# Altium project PCB.PrjPcb (part 4 of 8)

## Sheet POWER_MOTORS.SchDoc
size Tabloid; SheetNumber: 24; SheetTotal: 25; Sheet_Name: POWER; Size: 11x17
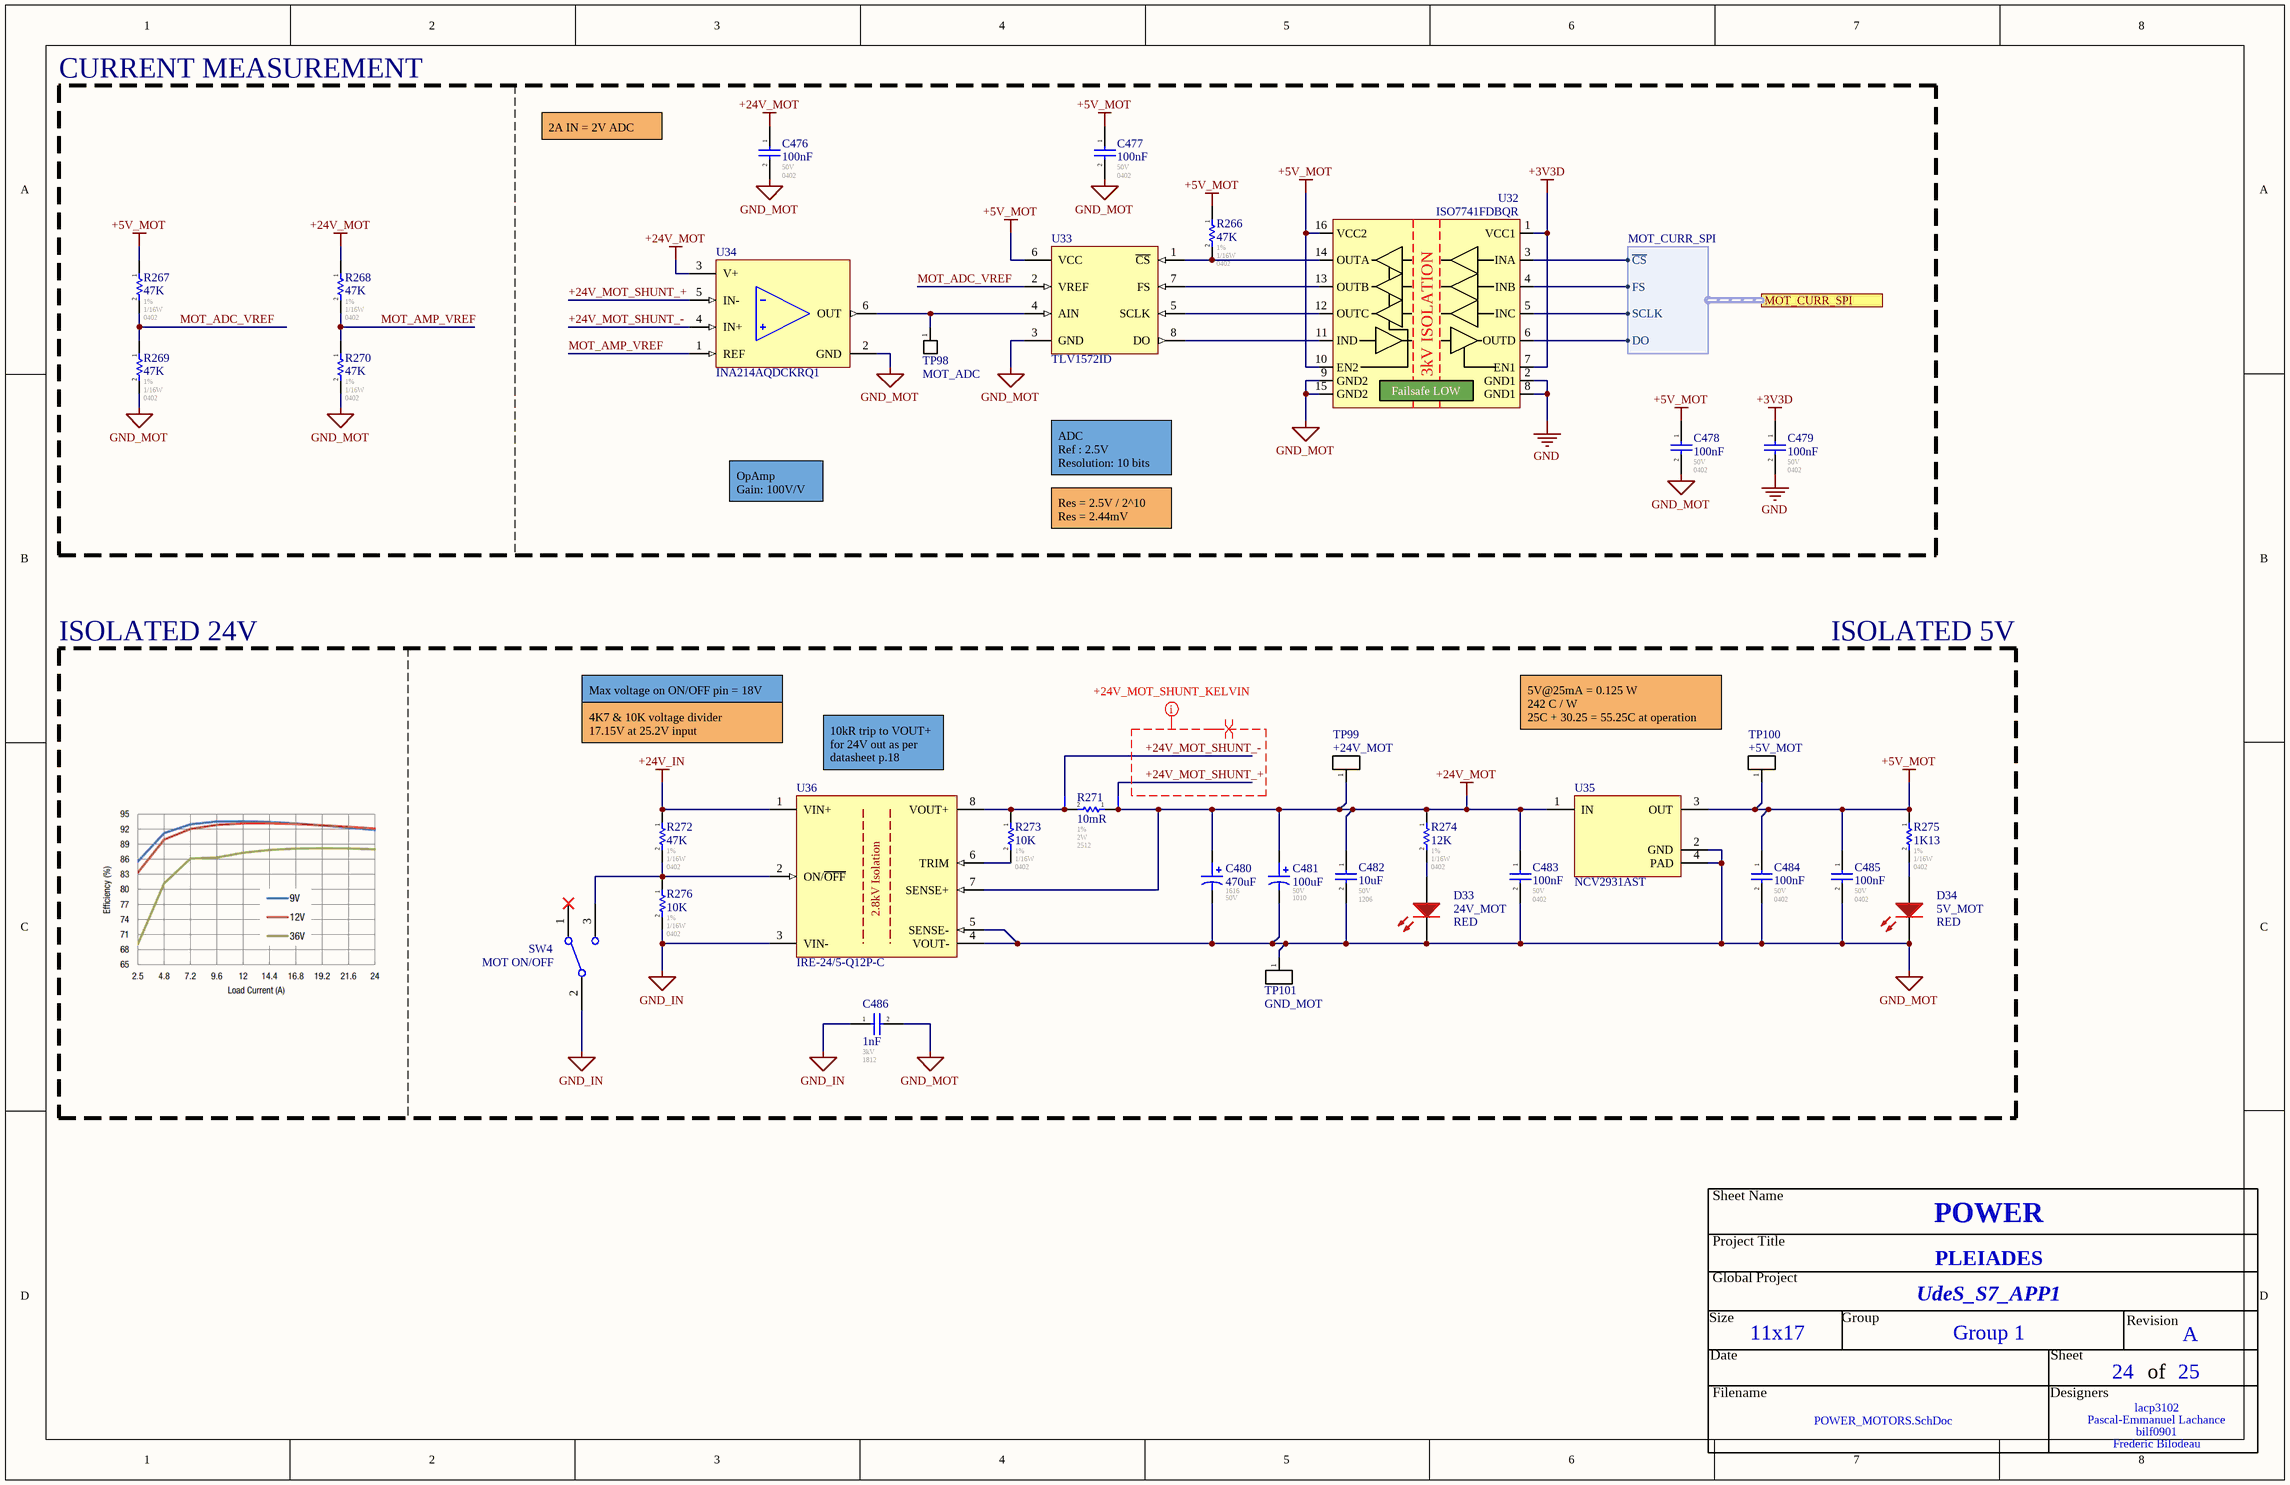
[diagram p22: POWER_MOTORS.SchDoc]

### Parts
C476  100nF  Voltage - Rated: 50V  Footprint: 0402  [CAP_0402]
C477  100nF  Voltage - Rated: 50V  Footprint: 0402  [CAP_0402]
C478  100nF  Voltage - Rated: 50V  Footprint: 0402  [CAP_0402]
C479  100nF  Voltage - Rated: 50V  Footprint: 0402  [CAP_0402]
C480  value 470uF  Voltage: 50V  Package: 1616  [CAP_ALU_1616_vishay]  (hidden comment: MAL214699108E3)
C481  value 100uF  Voltage: 50V  Package: 1010  [CAP_ALU_1010_vishay]  (hidden comment: MAL215099101E3)
C482  10uF  Voltage - Rated: 50V  Footprint: 1206  [CAP_1206]
C483  100nF  Voltage - Rated: 50V  Footprint: 0402  [CAP_0402]
C484  100nF  Voltage - Rated: 50V  Footprint: 0402  [CAP_0402]
C485  100nF  Voltage - Rated: 50V  Footprint: 0402  [CAP_0402]
C486  1nF  Voltage - Rated: 3kV  Footprint: 1812  [CAP_1812]
D33  24V_MOT  value RED  [LED_0603]
D34  5V_MOT  value RED  [LED_0603]
NT52  Net Tie  [NETTIE_5]  (value not drawn)  (net tie, no BOM)
NT53  Net Tie  [NETTIE_5]  (value not drawn)  (net tie, no BOM)
R266  47K  Tolerance: 1%  Power: 1/16W  Package / Case: 0402  [RES_0402]
R267  47K  Tolerance: 1%  Power: 1/16W  Package / Case: 0402  [RES_0402]
R268  47K  Tolerance: 1%  Power: 1/16W  Package / Case: 0402  [RES_0402]
R269  47K  Tolerance: 1%  Power: 1/16W  Package / Case: 0402  [RES_0402]
R270  47K  Tolerance: 1%  Power: 1/16W  Package / Case: 0402  [RES_0402]
R271  10mR  Tolerance: 1%  Power: 2W  Package / Case: 2512  [RES_2512]
R272  47K  Tolerance: 1%  Power: 1/16W  Package / Case: 0402  [RES_0402]
R273  10K  Tolerance: 1%  Power: 1/16W  Package / Case: 0402  [RES_0402]
R274  12K  Tolerance: 1%  Power: 1/16W  Package / Case: 0402  [RES_0402]
R275  1K13  Tolerance: 1%  Power: 1/16W  Package / Case: 0402  [RES_0402]
R276  10K  Tolerance: 1%  Power: 1/16W  Package / Case: 0402  [RES_0402]
SW4  MOT ON/OFF  [1101M2S3CQE2]
TP98  MOT_ADC  [TP_PAD]  (no BOM)
TP99  +24V_MOT  [TP_HOLE]  (no BOM)
TP100  +5V_MOT  [TP_HOLE]  (no BOM)
TP101  GND_MOT  [TP_HOLE]  (no BOM)
U32  ISO7741FDBQR  [ISO_ISO7741FDBQR]
U33  TLV1572ID  [SOIC-8_3.8mm]
U34  INA214AQDCKRQ1  [SC-70-6 (SOT-363)]
U35  NCV2931AST  [SOT223-4]
U36  IRE-24/5-Q12P-C  [IRE-Q12]

### Blocks framed on the sheet
CURRENT MEASUREMENT: C476-C479 R266-R270 TP98 U32-U34

### Ports
MOT_CURR_SPI (harness MOT_CURR_SPI)

### Harnesses
MOT_CURR_SPI: ~{CS}, FS, SCLK, DO

### Nets
+3V3D: C479.1 U32.1(VCC1) U32.7(EN1)
+5V_MOT: C477.1 C478.1 C484.1 C485.1 R266.1 R267.1 R275.1 TP100.1(A) U32.10(EN2) U32.16(VCC2) U33.6(VCC) U35.3(OUT)
+24V_IN: R272.1 U36.1(VIN+)
+24V_MOT: C476.1 C480.1 C481.1 C482.1 C483.1 NT53.1 R268.1 R271.1 R274.1 TP99.1(A) U34.3(V+) U35.1(IN) U36.7(SENSE+)
GND: C479.2 U32.2(GND1) U32.8(GND1)
GND_IN: C486.1 R276.2 SW4.2(P) U36.3(VIN-)
GND_MOT: C476.2 C477.2 C478.2 C480.2 C481.2 C482.2 C483.2 C484.2 C485.2 C486.2 D33.2(K) D34.2(K) R269.2 R270.2 TP101.1(A) U32.9(GND2) U32.15(GND2) U33.3(GND) U34.2(GND) U35.2(GND) U35.4(PAD) U36.4(VOUT-) U36.5(SENSE-)
+24V_MOT_SHUNT_+: NT53.2 U34.5(IN-)  [project net +24V_MOT_SHUNT_+_24]
+24V_MOT_SHUNT_-: NT52.2 U34.4(IN+)  [project net +24V_MOT_SHUNT_-_24]
MOT_ADC_VREF: R267.2 R269.1 U33.2(VREF)  [project net MOT_ADC_VREF_24]
MOT_AMP_VREF: R268.2 R270.1 U34.1(REF)  [project net MOT_AMP_VREF_24]
NetD33_1: D33.1(A) R274.2
NetD34_1: D34.1(A) R275.2
NetNT52_1: NT52.1 R271.2 R273.1 U36.8(VOUT+)
NetR266_2: R266.2 U32.14(OUTA) U33.1(~{CS})
NetR272_2: R272.2 R276.1 SW4.3(B) U36.2(ON/~{OFF})
NetR273_2: R273.2 U36.6(TRIM)
NetTP98_1: TP98.1(A) U33.4(AIN) U34.6(OUT)
NetU4_T18: U32.4(INB) ; port MOT_CURR_SPI.FS
NetU4_T19: U32.5(INC) ; port MOT_CURR_SPI.SCLK
NetU4_U21: U32.6(OUTD) ; port MOT_CURR_SPI.DO
NetU4_U23: U32.3(INA) ; port MOT_CURR_SPI.~{CS}
NetU32_11: U32.11(IND) U33.8(DO)
NetU32_12: U32.12(OUTC) U33.5(SCLK)
NetU32_13: U32.13(OUTB) U33.7(FS)

Not connected (* = marked no-connect by the designer): SW4 1(A)*

### Layout directives
net class +24V_MOT_SHUNT_KELVIN: +24V_MOT_SHUNT_+, +24V_MOT_SHUNT_-
differential pair: +24V_MOT_SHUNT_+, +24V_MOT_SHUNT_-

### Notes on the sheet
- 2A IN = 2V ADC
- OpAmp
  Gain: 100V/V
- ADC
  Ref : 2.5V
  Resolution: 10 bits
- Res = 2.5V / 2^10
  Res = 2.44mV
- ISOLATED 24V
- Max voltage on ON/OFF pin = 18V
- ISOLATED 5V
- 4K7 & 10K voltage divider
  17.15V at 25.2V input
- (near U36) 10kR trip to VOUT+ for 24V out as per datasheet p.18
- 5V@25mA = 0.125 W
  242 C / W
  25C + 30.25 = 55.25C at operation
- Sheet Name
- Project Title
- Global Project
- Revision
- Size
- Date
- Group
- Sheet
- of
- Filename
- Designers
- (in symbol IRE-24/5-Q12P-C) 2.8kV Isolation
- (in symbol ISO_ISO7741FDBQR) 3kV ISOLATION; Failsafe LOW

### Library data of the parts
C476-C479 C483-C485 = CAP_CER: as C222 on sheet POWER_INPUT; Operating Temperature: -55C - 125C; Temperature Coefficient: X7R; ComponentLink1Description: Digikey; ComponentLink1URL: [Digikey Link]; Part#: GCM155R71H104KE02J; ComponentLink2Description: Datasheet; ComponentLink2URL: [Datasheet Link]; Tolerance: 10%; Ratings: AEC-Q200
C480 = CAP_ALU_MAL214699108E3: CAP - ALU 470uF 20% 50V - 1616; Current: 1.3A; Mfg: Vishay Dale; Mfg Part Number: MAL214699108E3; HelpURL: http://www.vishay.com/docs/28403/146cti.pdf; CreatedBy: Jonathan Bouchard; Temperature: -55°C to 125°C; Power: *; Supplier 1: Digikey; Supplier Part Number 1: 4442PHCT-ND; Precision: 20%
C481 = CAP_ALU_MAL215099101E3: CAP - ALU 100uF 20% 50V - 1010; Current: 490mA; Mfg: Vishay Dale; Mfg Part Number: MAL215099101E3; HelpURL: http://www.vishay.com/docs/28395/150crz.pdf; CreatedBy: Jonathan Bouchard; Temperature: -55°C to 125°C; Power: *; Supplier 1: Digikey; Supplier Part Number 1: 4399PHDKR-ND; Precision: 20%
C482 = CAP_CER: as C221 on sheet POWER_INPUT; Operating Temperature: -55C - 85C; Temperature Coefficient: X5R; ComponentLink1Description: Digikey; ComponentLink1URL: [Digikey Link]; ComponentLink2Description: Datasheet; ComponentLink2URL: [Datasheet Link]; Tolerance: 10%; Ratings: AEC-Q200; Supplier 1: Arrow Electronics; Supplier Part Number 1: GRT31CR61H106KE01L; Part#: GRT31CR61H106KE01L
C486 = CAP_CER: C1812C102KHRACAUTO / 0402 470pF 10% X7R Ceramic Capacitor; Mfr: KEMET; Operating Temperature: -55C - 125C; Temperature Coefficient: X7R; ComponentLink1Description: Digikey; ComponentLink1URL: https://www.digikey.com/en/products/detail/kemet/C1812C102KHRACAUTO/8109956; Part#: C1812C102KHRACAUTO; ComponentLink2Description: Datasheet; ComponentLink2URL: https://connect.kemet.com:7667/gateway/IntelliData-ComponentDocumentation/1.0/download/datasheet/C1812C102KHRACAUTO; Tolerance: 10%; Ratings: AEC-Q200; ComponentLink3Description: KEMET; ComponentLink3URL: https://www.kemet.com/en/us/capacitors/ceramic/product/C1812C102KHRACAUTO.html; ComponentLink4Description: Octopart; ComponentLink4URL: https://octopart.com/c1812c102khracauto-kemet-67309371?r=sp; Features: Low ESL, High Voltage; Supplier 1: Mouser; Supplier Part Number 1: 80-C1812C102KHRAUTO
D33 D34 = LED_SML-311UTT86: as D4 on sheet POWER_INPUT; Current: 2mA; HelpURL: http://media.digikey.com/pdf/Data%20Sheets/Rohm%20PDFs/SML-311%20Series.pdf; CreatedBy: Jonathan Bouchard; Temperature: -30°C to 85°C; Package: 0603; Precision: *; Mfg Part Number: SML-311UTT86; Supplier 1: Digikey; Supplier Part Number 1: 511-1304-1-ND
NT52 NT53 = NET_TIE_SMALL
R266-R270 R272-R276 = RESISTOR: Automotive: AEC-Q200; Operating Temperature: *; # Digikey: *; ComponentLink1Description: Digikey; ComponentLink1URL: *; # Manufacturer: *
R271 = RESISTOR: CSRN2512FK10L0; Automotive: AEC-Q200; Operating Temperature: -55C - 155C; ComponentLink1Description: Digikey; ComponentLink1URL: https://www.digikey.ca/fr/products/detail/stackpole-electronics-inc/CSRN2512FK10L0/1646104; Part #: CSRN2512FK10L0
SW4 = SPDT_SWITCH: Slide Switch SPDT Through Hole; Mfr: C&K; Switch Function: On-Off-On; Current Rating: 6A; Voltage Rating - AC: 120V; Voltage Rating - DC: 28V; Cycles: 40000; Operating Temperature: -30C - 65C; ComponentLink1Description: Digikey; ComponentLink1URL: https://www.digikey.ca/en/products/detail/c-k/1103M2S3CQE2/483721; ComponentLink2Description: Datasheet; ComponentLink2URL: https://www.ckswitches.com/media/1429/1000.pdf; ComponentLink3Description: Octopart; ComponentLink3URL: https://octopart.com/1103m2s3cqe2-c%26k+components-2492778?r=sp; Supplier 1: Arrow Electronics; Supplier Part Number 1: 1103M2S3CQE2
TP98 = TESTPOINT_PAD: Test Point
TP99-TP101 = TESTPOINT: Test Point; ClassName: Testpoint
U32 = ISO_ISO7741FDBQR: ISO - Quad-Channel Digital Isolator 3/1 (Default Low)- 16-SSOP; Manufacturer #1: Texas Instruments; Voltage Rating: 2.25-5.5V; GRAMS Lib Spec: 2.8c; Magnetic Material: Unknown; Polarized: Yes; Value: 3/1; Tolerance: *; Current Rating: *; Power Max: *; HelpURL: http://www.ti.com/lit/ds/symlink/iso7741.pdf; CreatedBy/Date: Louis-Daniel Gaulin / 11-03-2020; VerifiedBy: c.Paulin - 20/04/2020; Temperature: -55°C ~ 125°C; Package: 16-SSOP; Manufacturer #2: *; Assembly Type: SMD; Part Number #2: *; Part Number #1: ISO7741FDBQR; Supplier 1: Digi-Key; Supplier Part Number 1: 296-48140-1-ND; Cryo: UNKNOWN
U33 = TLV1572ID: Mfr: Texas Instruments; Number of Bits: 10; Number of Inputs: 1; Architecture: SAR; Voltage - Supply (Analog): 2.7V - 5.5V; ComponentLink1Description: Digikey; ComponentLink1URL: https://www.digikey.ca/en/products/detail/texas-instruments/TLV1572ID/277528; ComponentLink2Description: Datasheet; ComponentLink2URL: https://www.ti.com/lit/ds/symlink/tlv1572.pdf?HQS=dis-dk-null-digikeymode-dsf-pf-null-wwe&ts=1706610861795&ref_url=https%253A%252F%252Fwww.ti.com%252Fgeneral%252Fdocs%252Fsuppproductinfo.tsp%253FdistId%253D10%2526gotoUrl%253Dhttps%253A%252F%252Fwww.ti.com%252Flit%252Fgpn%252Ftlv1572; ComponentLink3Description: Texas Instruments; ComponentLink3URL: https://www.ti.com/product/TLV1572; Voltage - Supply (Digital): 2.7V - 5.5V; Operating Temperature: -30C - 85C
U34 = INA214AQDCKRQ1: Current Sense Amplifier 1 Circuit Single-Ended SC-70-6; Mfr: Texas Instruments; Voltage - Supply (Min): 2.7V; Voltage - Supply (Max): 26V; Gain Bandwidth Product: 30kHz; Current - Input Bias: 28µA; Voltage - Input Offset: 1µV; Gain: 100V/V; ComponentLink1Description: Digikey; ComponentLink1URL: https://www.digikey.com/en/products/detail/texas-instruments/INA214AQDCKRQ1/2361055; ComponentLink2Description: Datasheet; ComponentLink2URL: https://www.ti.com/lit/ds/symlink/ina213-q1.pdf?HQS=dis-dk-null-digikeymode-dsf-pf-null-wwe&ts=1706525130563&ref_url=https%253A%252F%252Fwww.ti.com%252Fgeneral%252Fdocs%252Fsuppproductinfo.tsp%253FdistId%253D10%2526gotoUrl%253Dhttps%253A%252F%252Fwww.ti.com%252Flit%252Fgpn%252Fina213-q1; ComponentLink3Description: Octopart; ComponentLink3URL: https://octopart.com/ina214aqdckrq1-texas+instruments-18804705?r=sp; ComponentLink4Description: Texas Instruments; ComponentLink4URL: https://www.ti.com/product/INA214-Q1/part-details/INA214AQDCKRQ1; Operating Temperature: -40C - 125C; Ratings: AEC-Q100; Voltage - Analog Input (Max): 26V; Supplier 1: Mouser
U35 = NCV2931AST-5T3G: 5.0 V LDO; Voltage - Input (Max): 26V; Voltage - Output: 5V; Current - Output (Max): 100mA; Current - Quiescent: 1mA; Qualification: AEC-Q100; Operating Temperature: -40C - 125C; ComponentLink1Description: Digikey; ComponentLink1URL: https://www.digikey.ca/en/products/detail/onsemi/NCV2931AST-5T3G/1483949; ComponentLink2Description: Datasheet; ComponentLink2URL: https://www.onsemi.com/pdf/datasheet/lm2931-d.pdf
U36 = IRE-24/5-Q12P-C: Isolated DC/DC Converters - Through Hole 9V-36VIN 24VOUT 120W; Mfr: Murata; Voltage - Output: 24V; Current - Output: 5A; Voltage - Input (Min): 9V; Voltage - Input (Max): 36V; Isolation Voltage: 2.828kV; Switching Frequency: 240kHz; Output Power: 120W; Operating Temperature: -40C - 85C; ComponentLink1Description: Mouser; ComponentLink1URL: https://www.mouser.ca/ProductDetail/Murata-Power-Solutions/IRE-24-5-Q12P-C?qs=xZ%2FP%252Ba9zWqZkiEXUCSXVgg%3D%3D; ComponentLink2Description: Murata; ComponentLink2URL: https://www.murata.com/en-us/products/productdetail?partno=IRE-24%2F5-Q12P-C; ComponentLink3Description: Datasheet; ComponentLink3URL: https://www.murata.com/products/productdata/8807029112862/ire-q12.pdf?1655388012000; ComponentLink4Description: Octopart; ComponentLink4URL: https://octopart.com/ire-24%2F5-q12p-c-murata+power+solutions-107236523?r=sp; Supplier 1: Mouser; Supplier Part Number 1: 580-IRE-24/5-Q12P-C

## Sheet POWER_SENSING.SchDoc
size 558 x 431 mm; SheetNumber: 25; SheetTotal: 25; Sheet_Name: POWER; Size: 11x17
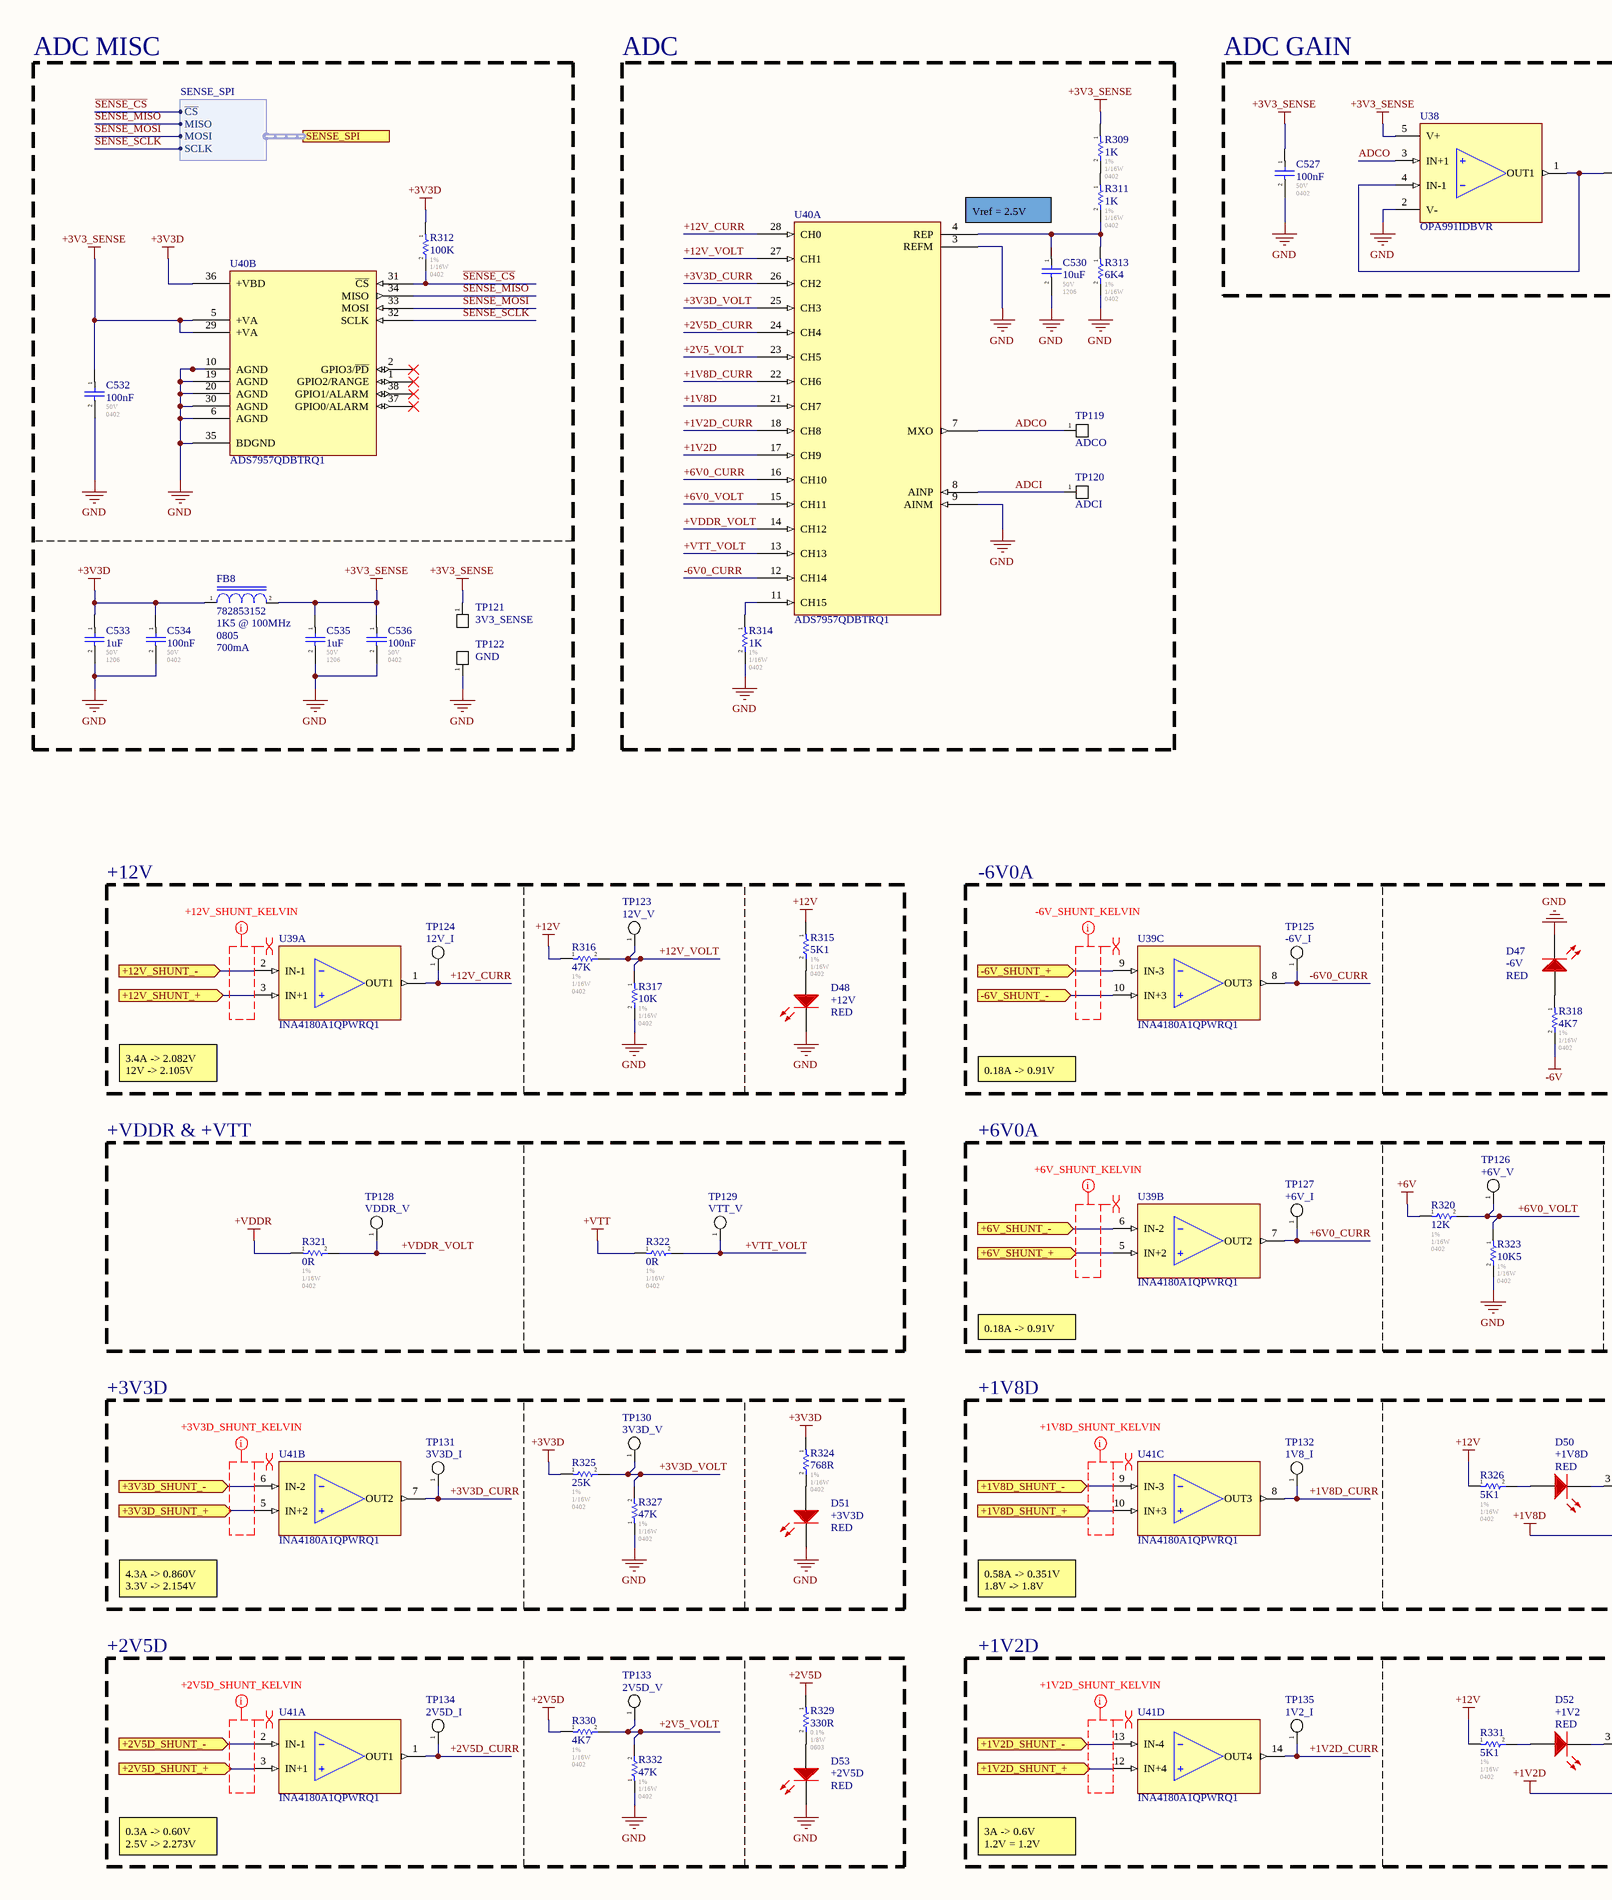
[diagram p23: POWER_SENSING.SchDoc, left]
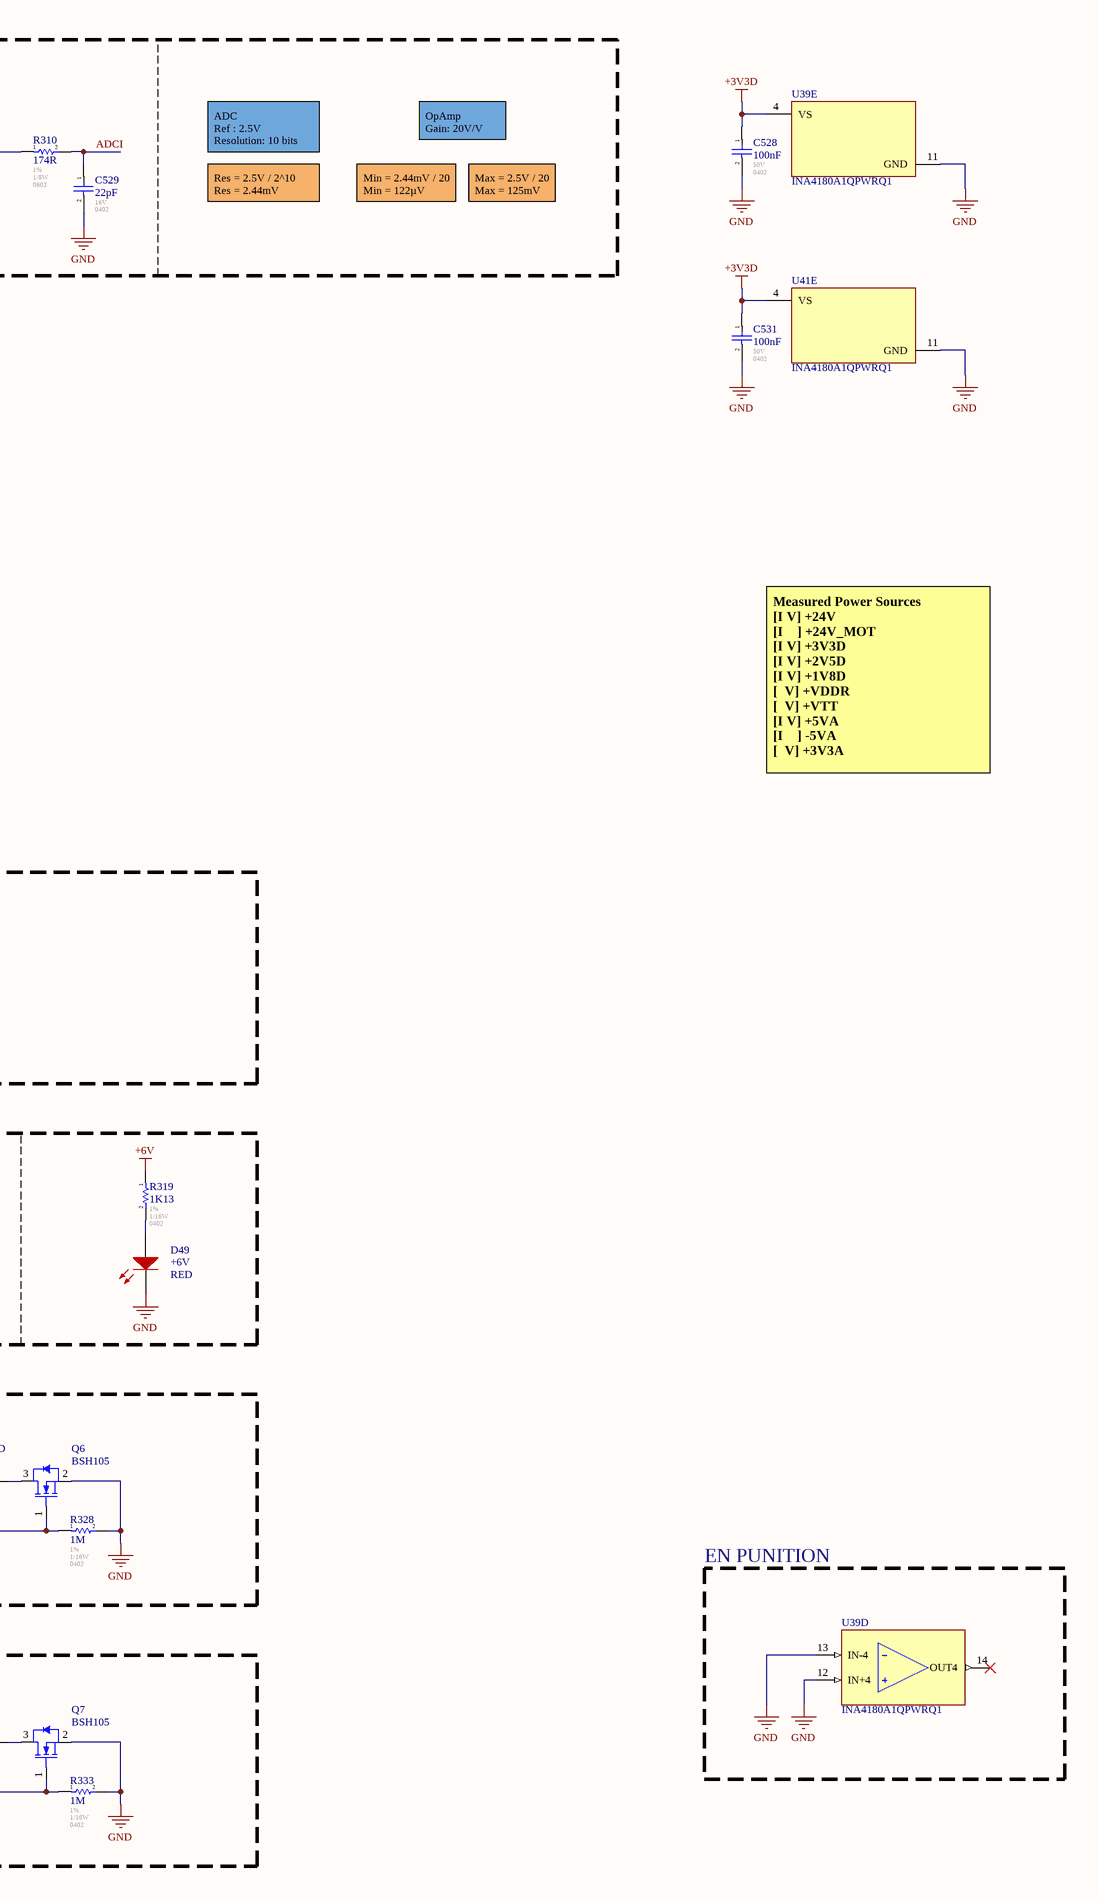
[diagram p24: POWER_SENSING.SchDoc, right]

### Parts
C527  100nF  Voltage - Rated: 50V  Footprint: 0402  [CAP_0402]
C528  100nF  Voltage - Rated: 50V  Footprint: 0402  [CAP_0402]
C529  22pF  Voltage - Rated: 16V  Footprint: 0402  [CAP_0402]
C530  10uF  Voltage - Rated: 50V  Footprint: 1206  [CAP_1206]
C531  100nF  Voltage - Rated: 50V  Footprint: 0402  [CAP_0402]
C532  100nF  Voltage - Rated: 50V  Footprint: 0402  [CAP_0402]
C533  1uF  Voltage - Rated: 50V  Footprint: 1206  [CAP_1206]
C534  100nF  Voltage - Rated: 50V  Footprint: 0402  [CAP_0402]
C535  1uF  Voltage - Rated: 50V  Footprint: 1206  [CAP_1206]
C536  100nF  Voltage - Rated: 50V  Footprint: 0402  [CAP_0402]
D47  -6V  value RED  [LED_0603]
D48  +12V  value RED  [LED_0603]
D49  +6V  value RED  [LED_0603]
D50  +1V8D  value RED  [LED_0603]
D51  +3V3D  value RED  [LED_0603]
D52  +1V2  value RED  [LED_0603]
D53  +2V5D  value RED  [LED_0603]
FB8  782853152  Impedance @ Freq: 1K5 @ 100MHz  Package / Case: 0805  Current Rating: 700mA  [IND_0805]
Q6  BSH105  [SOT23-3]
Q7  BSH105  [SOT23-3]
R309  1K  Tolerance: 1%  Power: 1/16W  Package / Case: 0402  [RES_0402]
R310  174R  Tolerance: 1%  Power: 1/8W  Package / Case: 0603  [RES_0603]
R311  1K  Tolerance: 1%  Power: 1/16W  Package / Case: 0402  [RES_0402]
R312  100K  Tolerance: 1%  Power: 1/16W  Package / Case: 0402  [RES_0402]
R313  6K4  Tolerance: 1%  Power: 1/16W  Package / Case: 0402  [RES_0402]
R314  1K  Tolerance: 1%  Power: 1/16W  Package / Case: 0402  [RES_0402]
R315  5K1  Tolerance: 1%  Power: 1/16W  Package / Case: 0402  [RES_0402]
R316  47K  Tolerance: 1%  Power: 1/16W  Package / Case: 0402  [RES_0402]
R317  10K  Tolerance: 1%  Power: 1/16W  Package / Case: 0402  [RES_0402]
R318  4K7  Tolerance: 1%  Power: 1/16W  Package / Case: 0402  [RES_0402]
R319  1K13  Tolerance: 1%  Power: 1/16W  Package / Case: 0402  [RES_0402]
R320  12K  Tolerance: 1%  Power: 1/16W  Package / Case: 0402  [RES_0402]
R321  0R  Tolerance: 1%  Power: 1/16W  Package / Case: 0402  [RES_0402]
R322  0R  Tolerance: 1%  Power: 1/16W  Package / Case: 0402  [RES_0402]
R323  10K5  Tolerance: 1%  Power: 1/16W  Package / Case: 0402  [RES_0402]
R324  768R  Tolerance: 1%  Power: 1/16W  Package / Case: 0402  [RES_0402]
R325  25K  Tolerance: 1%  Power: 1/16W  Package / Case: 0402  [RES_0402]
R326  5K1  Tolerance: 1%  Power: 1/16W  Package / Case: 0402  [RES_0402]
R327  47K  Tolerance: 1%  Power: 1/16W  Package / Case: 0402  [RES_0402]
R328  1M  Tolerance: 1%  Power: 1/16W  Package / Case: 0402  [RES_0402]
R329  330R  Tolerance: 0.1%  Power: 1/8W  Package / Case: 0603  [RES_0603]
R330  4K7  Tolerance: 1%  Power: 1/16W  Package / Case: 0402  [RES_0402]
R331  5K1  Tolerance: 1%  Power: 1/16W  Package / Case: 0402  [RES_0402]
R332  47K  Tolerance: 1%  Power: 1/16W  Package / Case: 0402  [RES_0402]
R333  1M  Tolerance: 1%  Power: 1/16W  Package / Case: 0402  [RES_0402]
TP119  ADCO  [TP_PAD]  (no BOM)
TP120  ADCI  [TP_PAD]  (no BOM)
TP121  3V3_SENSE  [TP_PAD]  (no BOM)
TP122  GND  [TP_PAD]  (no BOM)
TP123  12V_V  [TP_PAD_SMALL]  (no BOM)
TP124  12V_I  [TP_PAD_SMALL]  (no BOM)
TP125  -6V_I  [TP_PAD_SMALL]  (no BOM)
TP126  +6V_V  [TP_PAD_SMALL]  (no BOM)
TP127  +6V_I  [TP_PAD_SMALL]  (no BOM)
TP128  VDDR_V  [TP_PAD_SMALL]  (no BOM)
TP129  VTT_V  [TP_PAD_SMALL]  (no BOM)
TP130  3V3D_V  [TP_PAD_SMALL]  (no BOM)
TP131  3V3D_I  [TP_PAD_SMALL]  (no BOM)
TP132  1V8_I  [TP_PAD_SMALL]  (no BOM)
TP133  2V5D_V  [TP_PAD_SMALL]  (no BOM)
TP134  2V5D_I  [TP_PAD_SMALL]  (no BOM)
TP135  1V2_I  [TP_PAD_SMALL]  (no BOM)
U38  OPA991IDBVR  [SOT23-5]
U39  INA4180A1QPWRQ1  [TSSOP-14_4.4MM]  (parts A,B,C,D,E of 5)
U40  ADS7957QDBTRQ1  [TSSOP-38_4.4MM]  (parts A,B of 2)
U41  INA4180A1QPWRQ1  [TSSOP-14_4.4MM]  (parts A,B,C,D,E of 5)

### Blocks framed on the sheet
ADC MISC: C532-C536 FB8 R312 TP121 TP122 U40
ADC: C530 R309 R311 R313 R314 TP119 TP120 U40
ADC GAIN: C527 C529 R310 U38
+12V: D48 R315-R317 TP123 TP124 U39
-6V0A: D47 R318 TP125 U39
+VDDR & +VTT: R321 R322 TP128 TP129
+6V0A: D49 R319 R320 R323 TP126 TP127 U39
+3V3D: D51 R324 R325 R327 TP130 TP131 U41
+1V8D: D50 Q6 R326 R328 TP132 U41
EN PUNITION: U39
+2V5D: D53 R329 R330 R332 TP133 TP134 U41
+1V2D: D52 Q7 R331 R333 TP135 U41

### Ports
+1V2D_SHUNT_+ (in), +1V2D_SHUNT_- (in), +1V8D_SHUNT_+ (in), +1V8D_SHUNT_- (in), +2V5D_SHUNT_+ (in), +2V5D_SHUNT_- (in), +3V3D_SHUNT_+ (in), +3V3D_SHUNT_- (in), +6V_SHUNT_+ (in), +6V_SHUNT_- (in), +12V_SHUNT_+ (in), +12V_SHUNT_- (in), -6V_SHUNT_+ (in), -6V_SHUNT_- (in), SENSE_SPI (harness SENSE_SPI)

### Harnesses
SENSE_SPI: ~{CS}, MISO, MOSI, SCLK

### Nets
+1V2D: Q7.1(G) R333.1 U40.17(CH9)
+1V8D: Q6.1(G) R328.1 U40.21(CH7)
+2V5D: R329.1 R330.1
+3V3_SENSE: C527.1 C532.1 C535.1 C536.1 FB8.2 R309.1 TP121.1(A) U38.5(V+) U40.5(+VA) U40.29(+VA)
+3V3D: C528.1 C531.1 C533.1 C534.1 FB8.1 R312.1 R324.1 R325.1 U39.4(VS) U40.36(+VBD) U41.4(VS)
+6V: R319.1 R320.1
+12V: R315.1 R316.1 R326.1 R331.1
+VDDR: R321.1
+VTT: R322.1
-6V: R318.2
GND: C527.2 C528.2 C529.2 C530.2 C531.2 C532.2 C533.2 C534.2 C535.2 C536.2 D47.2(K) D48.2(K) D49.2(K) D51.2(K) D53.2(K) Q6.2(S) Q7.2(S) R313.2 R314.2 R317.2 R323.2 R327.1 R328.2 R332.1 R333.2 TP122.1(A) U38.2(V-) U39.11(GND) U39.12(IN+4) U39.13(IN-4) U40.3(REFM) U40.6(AGND) U40.9(AINM) U40.10(AGND) U40.19(AGND) U40.20(AGND) U40.30(AGND) U40.35(BDGND) U41.11(GND)
+1V2D_CURR: TP135.1(A) U40.18(CH8) U41.14(OUT4)  [project net +1V2D_CURR_25]
+1V2D_SHUNT_+: U41.12(IN+4) ; port +1V2D_SHUNT_+
+1V2D_SHUNT_-: U41.13(IN-4) ; port +1V2D_SHUNT_-
+1V8D_CURR: TP132.1(A) U40.22(CH6) U41.8(OUT3)  [project net +1V8D_CURR_25]
+1V8D_SHUNT_+: U41.10(IN+3) ; port +1V8D_SHUNT_+
+1V8D_SHUNT_-: U41.9(IN-3) ; port +1V8D_SHUNT_-
+2V5_VOLT: R330.2 R332.2 TP133.1(A) U40.23(CH5)  [project net +2V5_VOLT_25]
+2V5D_CURR: TP134.1(A) U40.24(CH4) U41.1(OUT1)  [project net +2V5D_CURR_25]
+2V5D_SHUNT_+: U41.3(IN+1) ; port +2V5D_SHUNT_+
+2V5D_SHUNT_-: U41.2(IN-1) ; port +2V5D_SHUNT_-
+3V3D_CURR: TP131.1(A) U40.26(CH2) U41.7(OUT2)  [project net +3V3D_CURR_25]
+3V3D_SHUNT_+: U41.5(IN+2) ; port +3V3D_SHUNT_+
+3V3D_SHUNT_-: U41.6(IN-2) ; port +3V3D_SHUNT_-
+3V3D_VOLT: R325.2 R327.2 TP130.1(A) U40.25(CH3)  [project net +3V3D_VOLT_25]
+6V0_CURR: TP127.1(A) U39.7(OUT2) U40.16(CH10)  [project net +6V0_CURR_25]
+6V0_VOLT: R320.2 R323.1 TP126.1(A) U40.15(CH11)  [project net +6V0_VOLT_25]
+6V_SHUNT_+: U39.5(IN+2) ; port +6V_SHUNT_+
+6V_SHUNT_-: U39.6(IN-2) ; port +6V_SHUNT_-
+12V_CURR: TP124.1(A) U39.1(OUT1) U40.28(CH0)  [project net +12V_CURR_25]
+12V_SHUNT_+: U39.3(IN+1) ; port +12V_SHUNT_+
+12V_SHUNT_-: U39.2(IN-1) ; port +12V_SHUNT_-
+12V_VOLT: R316.2 R317.1 TP123.1(A) U40.27(CH1)  [project net +12V_VOLT_25]
+VDDR_VOLT: R321.2 TP128.1(A) U40.14(CH12)  [project net +VDDR_VOLT_25]
+VTT_VOLT: R322.2 TP129.1(A) U40.13(CH13)  [project net +VTT_VOLT_25]
-6V0_CURR: TP125.1(A) U39.8(OUT3) U40.12(CH14)  [project net -6V0_CURR_25]
-6V_SHUNT_+: U39.9(IN-3) ; port -6V_SHUNT_+
-6V_SHUNT_-: U39.10(IN+3) ; port -6V_SHUNT_-
~{SENSE_CS}: R312.2 U40.31(~{CS}) ; port SENSE_SPI.~{CS}
ADCI: C529.1 R310.2 TP120.1(A) U40.8(AINP)  [project net ADCI_25]
ADCO: TP119.1(A) U38.3(IN+1) U40.7(MXO)  [project net ADCO_25]
SENSE_MISO: U40.34(MISO) ; port SENSE_SPI.MISO
SENSE_MOSI: U40.33(MOSI) ; port SENSE_SPI.MOSI
SENSE_SCLK: U40.32(SCLK) ; port SENSE_SPI.SCLK
NetC530_1: C530.1 R311.2 R313.1 U40.4(REP)
NetD47_1: D47.1(A) R318.1
NetD48_1: D48.1(A) R315.2
NetD49_1: D49.1(A) R319.2
NetD50_1: D50.1(A) R326.2
NetD50_2: D50.2(K) Q6.3(D)
NetD51_1: D51.1(A) R324.2
NetD52_1: D52.1(A) R331.2
NetD52_2: D52.2(K) Q7.3(D)
NetD53_1: D53.1(A) R329.2
NetR309_2: R309.2 R311.1
NetR310_1: R310.1 U38.1(OUT1) U38.4(IN-1)
NetR314_1: R314.1 U40.11(CH15)

Not connected (* = marked no-connect by the designer): U39 14(OUT4)*; U40 1(GPIO2/RANGE)* 2(GPIO3/~{PD})* 37(GPIO0/ALARM)* 38(GPIO1/ALARM)*

### Layout directives
net class +12V_SHUNT_KELVIN: (no net found under the mark)
net class +3V3D_SHUNT_KELVIN: (no net found under the mark)
net class +2V5D_SHUNT_KELVIN: (no net found under the mark)
net class +1V8D_SHUNT_KELVIN: (no net found under the mark)
net class +6V_SHUNT_KELVIN: (no net found under the mark)
net class -6V_SHUNT_KELVIN: (no net found under the mark)
net class +1V2D_SHUNT_KELVIN: (no net found under the mark)
differential pair: (no net found under the mark)

### Notes on the sheet
- ADC
  Ref : 2.5V
  Resolution: 10 bits
- OpAmp
  Gain: 20V/V
- Vref = 2.5V
- Res = 2.5V / 2^10
  Res = 2.44mV
- Min = 2.44mV / 20
  Min = 122µV
- Max = 2.5V / 20
  Max = 125mV
- Measured Power Sources
  [I V] +24V
  [I    ] +24V_MOT
  [I V] +3V3D
  [I V] +2V5D
  [I V] +1V8D
  [  V] +VDDR
  [  V] +VTT
  [I V] +5VA
  [I    ] -5VA
  [  V] +3V3A
- 3.4A -> 2.082V
  12V -> 2.105V
- 0.18A -> 0.91V
- 4.3A -> 0.860V
  3.3V -> 2.154V
- 0.58A -> 0.351V
  1.8V -> 1.8V
- 0.3A -> 0.60V
  2.5V -> 2.273V
- 3A -> 0.6V
  1.2V = 1.2V
- Sheet Name
- Project Title
- Global Project
- Revision
- Size
- Date
- Group
- Sheet
- of
- Filename
- Designers

### Library data of the parts
C527 C528 C531 C532 C534 C536 = CAP_CER: GCM155R71H104KE02J / 0402 100nF 10% X7R Ceramic Capacitor; Mfr: Murata; Operating Temperature: -55C - 125C; Temperature Coefficient: X7R; ComponentLink1Description: Digikey; ComponentLink1URL: [Digikey Link]; Part#: GCM155R71H104KE02J; ComponentLink2Description: Datasheet; ComponentLink2URL: [Datasheet Link]; Tolerance: 10%; Ratings: AEC-Q200
C529 = CAP_CER: 0402 22pF 10% X7R 16V Ceramic Capacitor / C0402C220K4RACAUTO; Mfr: KEMET; Operating Temperature: -55C - 125C; Temperature Coefficient: X7R; ComponentLink1Description: Digikey; ComponentLink1URL: https://www.digikey.ca/en/products/detail/kemet/c0402c220k4racauto/11676432; Part#: C0402C220K4RACAUTO; ComponentLink2Description: Datasheet; ComponentLink2URL: https://connect.kemet.com:7667/gateway/IntelliData-ComponentDocumentation/1.0/download/datasheet/C0402C220K4RACAUTO; Tolerance: 10%; Ratings: AEC-Q200; ComponentLink3Description: Octopart; ComponentLink3URL: https://octopart.com/c0402c220k4racauto-kemet-91893749?r=sp; ComponentLink4Description: Kemet; ComponentLink4URL: https://www.kemet.com/en/us/capacitors/ceramic/product/C0402C220K4RACAUTO.html; ComponentLink5Description: Specsheet; ComponentLink5URL: https://search.kemet.com/component-documentation/download/specsheet/C0402C220K4RACAUTO; Supplier 1: Mouser; Supplier Part Number 1: 80-C0402C220K4RAUTO
C530 = CAP_CER: GRT31CR61H106KE01L / 1206 10uF 10% X5R Ceramic Capacitor; Mfr: Murata; Operating Temperature: -55C - 85C; Temperature Coefficient: X5R; ComponentLink1Description: Digikey; ComponentLink1URL: [Digikey Link]; ComponentLink2Description: Datasheet; ComponentLink2URL: [Datasheet Link]; Tolerance: 10%; Ratings: AEC-Q200; Supplier 1: Arrow Electronics; Supplier Part Number 1: GRT31CR61H106KE01L; Part#: GRT31CR61H106KE01L
C533 C535 = CAP_CER: GCJ31CR71H105KA12L / 1206 1uF 10% X7R Ceramic Capacitor; Mfr: Murata; Operating Temperature: -55C - 125C; Temperature Coefficient: X7R; ComponentLink1Description: Digikey; ComponentLink1URL: [Digikey Link]; Part#: GCJ31CR71H105KA12L; ComponentLink2Description: Datasheet; ComponentLink2URL: [Datasheet Link]; Tolerance: 10%; Ratings: AEC-Q200
D47-D53 = LED_SML-311UTT86: LED - 620nM RED 2mA - 0603; Voltage: 1.8V; Mfg: ROHM Semiconductor; Power: 44mW; Current: 2mA; HelpURL: http://media.digikey.com/pdf/Data%20Sheets/Rohm%20PDFs/SML-311%20Series.pdf; CreatedBy: Jonathan Bouchard; Temperature: -30°C to 85°C; Package: 0603; Precision: *; Mfg Part Number: SML-311UTT86; Supplier 1: Digikey; Supplier Part Number 1: 511-1304-1-ND
FB8 = FERRITE_BEAD: 600 Ohms @ 100 MHz 1 Signal Line Ferrite Bead 0603 (1608 Metric) 1A 200mOhm; Manufacturer: Wurth Elektronik; Resistance: 350mR; Operating Temperature: -55C - 125C; Rating: AEC-Q200; ComponentLink1Description: Digikey; ComponentLink1URL: https://www.digikey.ca/en/products/detail/w%C3%BCrth-elektronik/782853152/5168812; ComponentLink3Description: Octopart; ComponentLink3URL: https://octopart.com/782853152-wurth+elektronik-56466774?r=sp; ComponentLink5Description: Datasheet; ComponentLink5URL: https://www.we-online.com/en/components/products/datasheet/782853152.pdf
Q6 Q7 = TRX_NMOS_SI2310-TP: Manufacturer #1: Micro Commercial Co; Current Rating: 3A; Power Max: 350mW; Voltage rating: 60V (Vds max), 2V (Vgs @ 250uA); Polarized: Yes; Magnetic Material: UNKNOWN; GRAMS Lib Spec: 2.8c; Manufacturer #2: *; Value: *; Part Number #1: SI2310-TP; Part Number #2: *; HelpURL: https://www.mccsemi.com/pdf/Products/SI2310(SOT-23)-A.pdf; Assembly Type: SMD; Temperature: -55°C ~ 150°C (TJ); Package: SOT-23; CreatedBy/Date: Louis-Daniel Gaulin / 20-02-2020; Tolerance: *; VerifiedBy: C.Paulin - 21/02/2020; Cryo: UNKNOWN; Supplier 1: Avnet; Supplier Part Number 1: BSH105,215
R309-R327 R330-R332 = RESISTOR: Automotive: AEC-Q200; Operating Temperature: *; # Digikey: *; ComponentLink1Description: Digikey; ComponentLink1URL: *; # Manufacturer: *
R328 R333 = RESISTOR: 1M 0402 1% 1/16W Resistor; Automotive: AEC-Q200; Operating Temperature: *; # Digikey: *; ComponentLink1Description: Digikey; ComponentLink1URL: *; # Manufacturer: *
R329 = RESISTOR: 1M 0603 1% 1/16W Resistor; Automotive: AEC-Q200; Operating Temperature: *; # Digikey: *; ComponentLink1Description: Digikey; ComponentLink1URL: *; # Manufacturer: *
TP119-TP122 = TESTPOINT_PAD: Test Point
TP123-TP135 = TESTPOINT_PAD_SMALL: Test Point
U38 = OPA991IDBVR: General Purpose Amplifier 1 Circuit Rail-to-Rail SOT-23-5; Mfr: Texas Instruments; Voltage - Supply (Min): 2.7V; Voltage - Supply (Max): 40V; Voltage - Input Offset: 125µV; Current - Input Bias: 10pA; Slew Rate: 21V/µs; Current - Output: 75mA; Part#: OPA991IDBVR; Output Type: Rail-to-Rail; Operating Temperature: -40C - 125C; ComponentLink1Description: Digikey; ComponentLink1URL: https://www.digikey.ca/en/products/detail/texas-instruments/OPA991IDBVR/13174045; ComponentLink2Description: Datasheet; ComponentLink2URL: https://www.ti.com/lit/ds/symlink/opa991.pdf; ComponentLink3Description: Texas Instruments; ComponentLink3URL: https://www.ti.com/product/OPA991/part-details/OPA991IDBVR; ComponentLink4Description: Octopart; ComponentLink4URL: https://octopart.com/search?q=OPA991IDBVR&autosugg_idx=0&currency=USD&specs=0; Supplier 1: Mouser; Supplier Part Number 1: 595-OPA991IDBVR
U39 U41 = INA4180A1QPWRQ1: Current Sense Amplifier 4 Circuit Differential, Rail-to-Rail 14-TSSOP; Mfr: Texas Instruments; Voltage - Supply (Min): 2.7V; Voltage - Supply (Max): 5.5V; Gain Bandwidth Product: 350kHz; Current - Input Bias: -100nA; Voltage - Input Offset: 100uV; Current - Output / Channel: 8mA; Gain: 20V/V; Voltage - Analog Input (Max): 26V; ComponentLink1Description: Digikey; ComponentLink1URL: https://www.digikey.com/en/products/detail/texas-instruments/INA4180A1QPWRQ1/9654220; ComponentLink2Description: Datasheet; ComponentLink2URL: https://www.ti.com/lit/ds/symlink/ina4180-q1.pdf; ComponentLink3Description: Octopart; ComponentLink3URL: https://octopart.com/ina4180a1qpwrq1-texas+instruments-94354202?r=sp; ComponentLink4Description: Texas Instruments; ComponentLink4URL: https://www.ti.com/product/INA4180-Q1/part-details/INA4180A1QPWRQ1; Operating Temperature: -40C - 125C; Ratings: AEC-Q100; Supplier 1: Mouser; Supplier Part Number 1: 595-INA4180A1QPWRQ1
U40 = ADS7957QDBTRQ1: 10 Bit Analog to Digital Converter 16 Input 1 SAR 38-TSSOP; Mfr: Texas Instruments; Number of Bits: 10; Number of Inputs: 16; Sampling Rate: 1M; Input Type: Single Ended; Supply Voltage - Analog (Min): 2.7V; Supply Voltage - Analog (Max): 5.25V; Supply Voltage - Digital (Min): 1.7V; Supply Voltage - Digital (Max): 5.25; Qualification: AEC-Q100; Part#: ADS7957QDBTRQ1; Architecture: SAR; Operating Temperature: -40C - 125C; ComponentLink1Description: Digikey; ComponentLink1URL: https://www.digikey.ca/en/products/detail/texas-instruments/ADS7957QDBTRQ1/4860369; ComponentLink2Description: Datasheet; ComponentLink2URL: https://www.ti.com/lit/ds/symlink/ads7957-q1.pdf; ComponentLink3Description: Texas Instruments; ComponentLink3URL: https://www.ti.com/product/ADS7957-Q1/part-details/ADS7957QDBTRQ1; ComponentLink4Description: Octopart; ComponentLink4URL: https://octopart.com/ads7957qdbtrq1-texas+instruments-43172431?r=sp; Supplier 1: Mouser; Supplier Part Number 1: 595-ADS7957QDBTRQ1

## Sheet PROM.SchDoc
size Tabloid; SheetNumber: 10; SheetTotal: 25; Sheet_Name: PROM; Size: 11x17
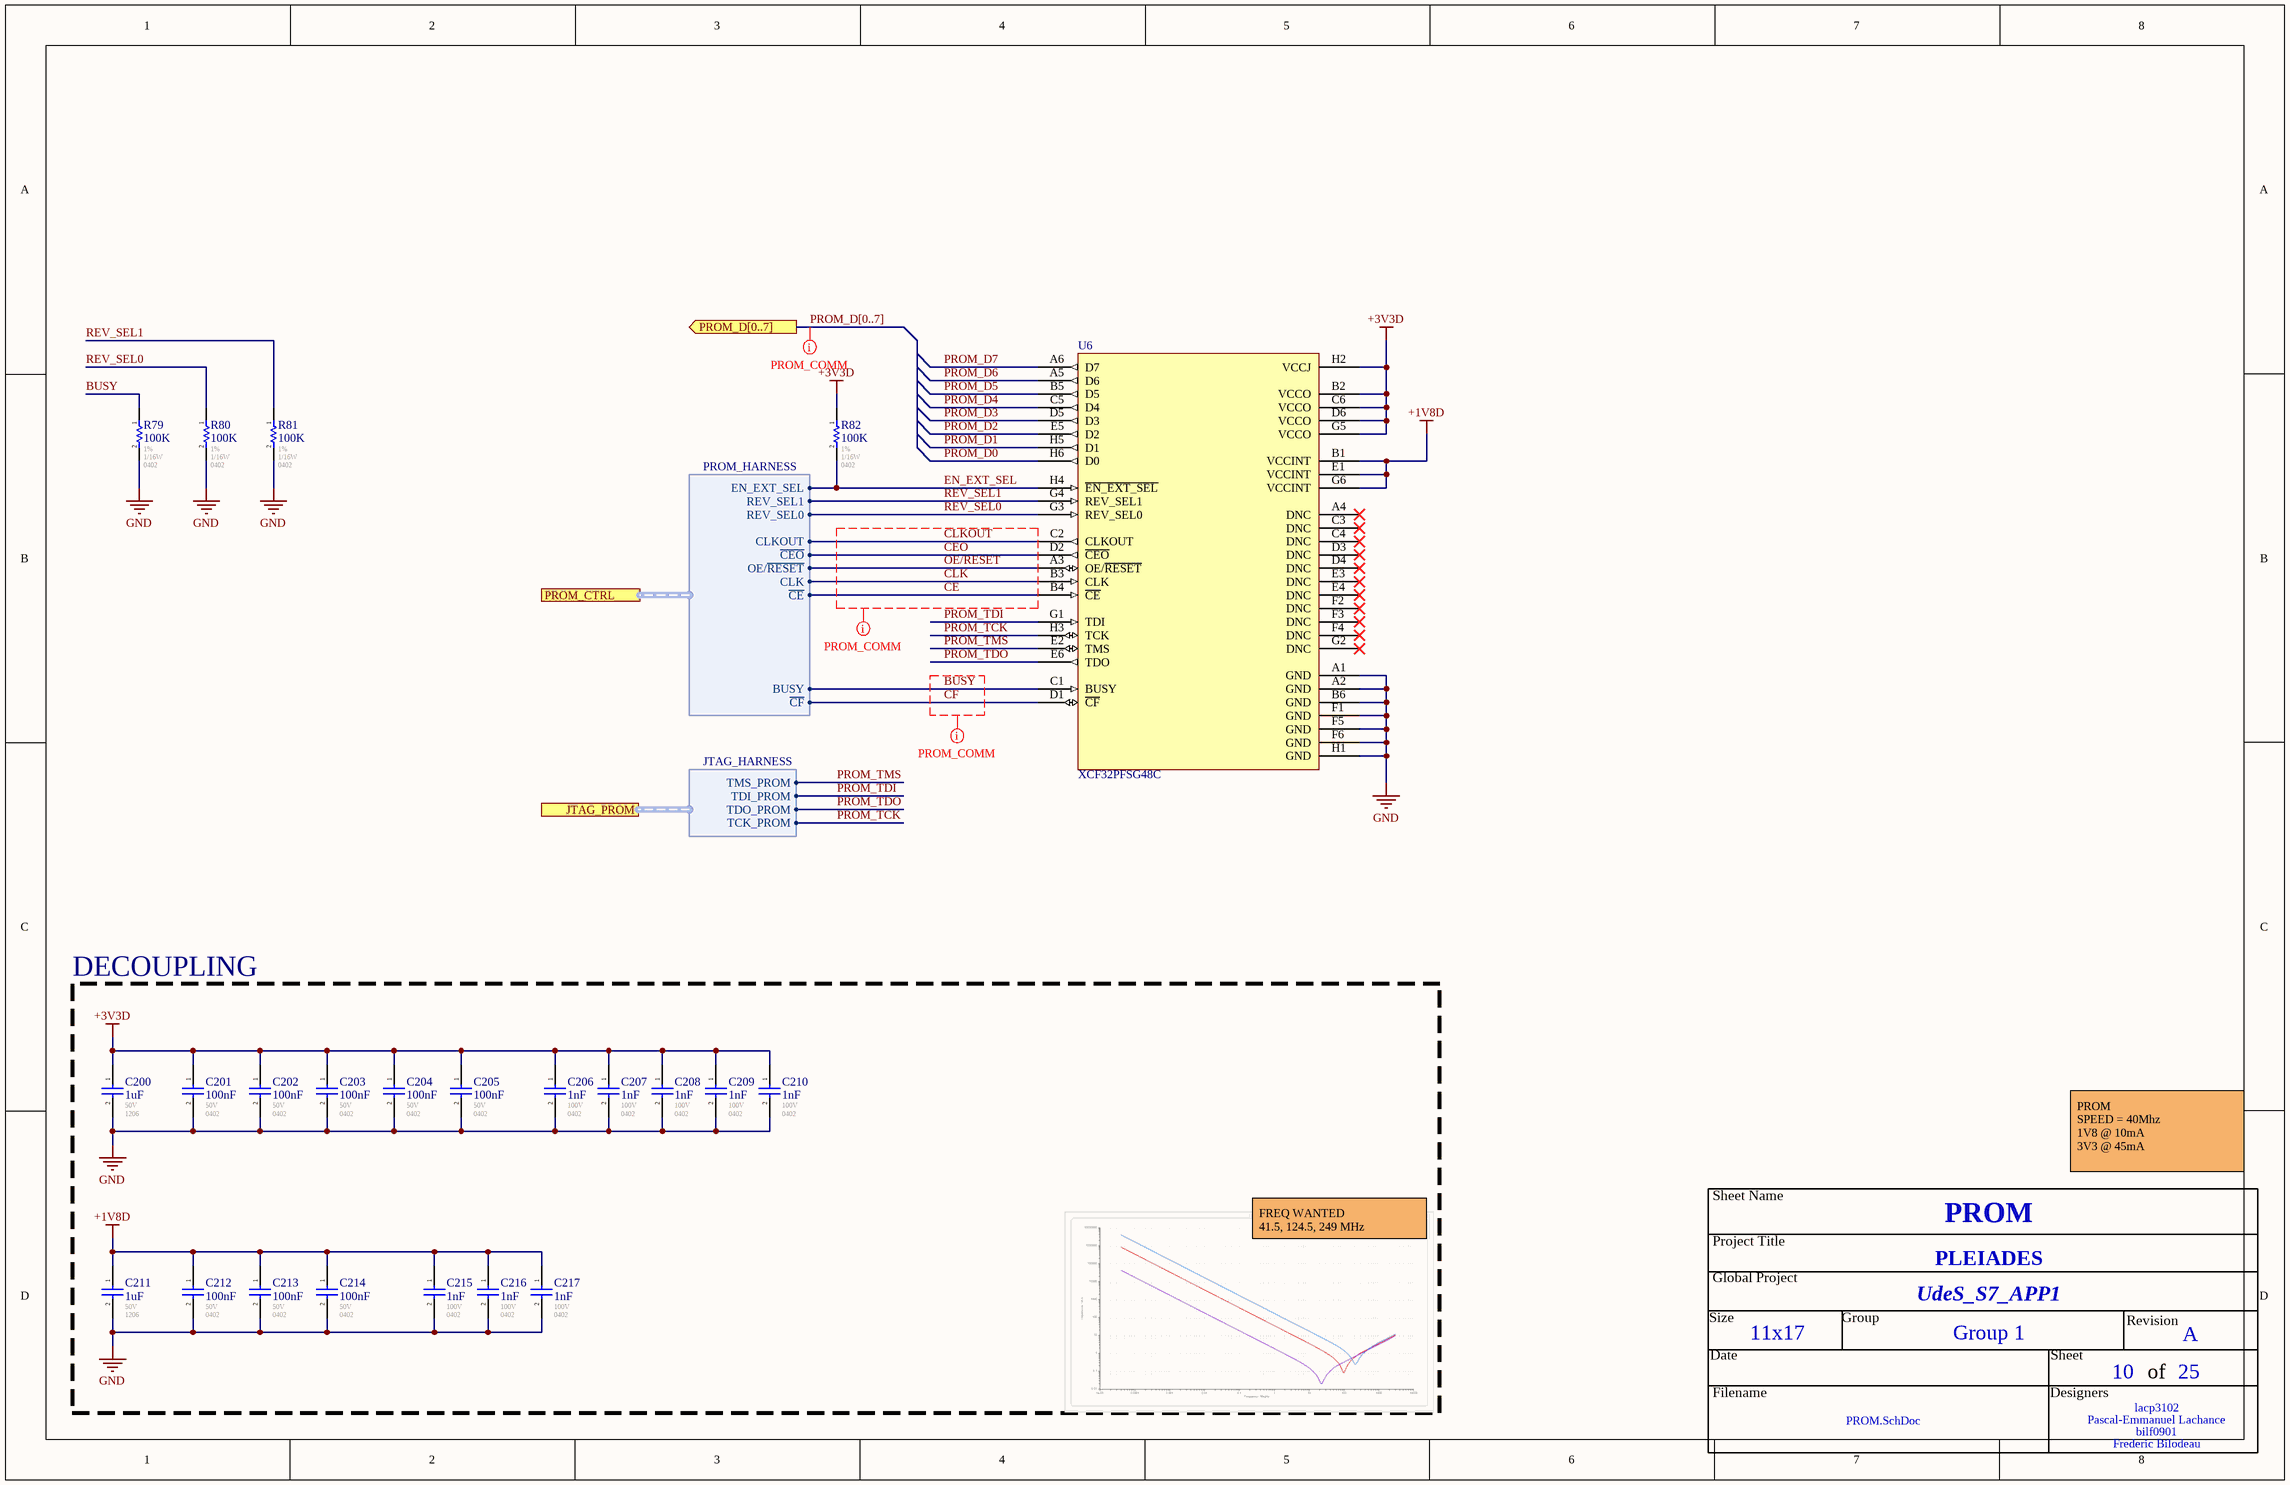
[diagram p25: PROM.SchDoc]

### Parts
C200  1uF  Voltage - Rated: 50V  Footprint: 1206  [CAP_1206]
C201  100nF  Voltage - Rated: 50V  Footprint: 0402  [CAP_0402]
C202  100nF  Voltage - Rated: 50V  Footprint: 0402  [CAP_0402]
C203  100nF  Voltage - Rated: 50V  Footprint: 0402  [CAP_0402]
C204  100nF  Voltage - Rated: 50V  Footprint: 0402  [CAP_0402]
C205  100nF  Voltage - Rated: 50V  Footprint: 0402  [CAP_0402]
C206  1nF  Voltage - Rated: 100V  Footprint: 0402  [CAP_0402]
C207  1nF  Voltage - Rated: 100V  Footprint: 0402  [CAP_0402]
C208  1nF  Voltage - Rated: 100V  Footprint: 0402  [CAP_0402]
C209  1nF  Voltage - Rated: 100V  Footprint: 0402  [CAP_0402]
C210  1nF  Voltage - Rated: 100V  Footprint: 0402  [CAP_0402]
C211  1uF  Voltage - Rated: 50V  Footprint: 1206  [CAP_1206]
C212  100nF  Voltage - Rated: 50V  Footprint: 0402  [CAP_0402]
C213  100nF  Voltage - Rated: 50V  Footprint: 0402  [CAP_0402]
C214  100nF  Voltage - Rated: 50V  Footprint: 0402  [CAP_0402]
C215  1nF  Voltage - Rated: 100V  Footprint: 0402  [CAP_0402]
C216  1nF  Voltage - Rated: 100V  Footprint: 0402  [CAP_0402]
C217  1nF  Voltage - Rated: 100V  Footprint: 0402  [CAP_0402]
R79  100K  Tolerance: 1%  Power: 1/16W  Package / Case: 0402  [RES_0402]
R80  100K  Tolerance: 1%  Power: 1/16W  Package / Case: 0402  [RES_0402]
R81  100K  Tolerance: 1%  Power: 1/16W  Package / Case: 0402  [RES_0402]
R82  100K  Tolerance: 1%  Power: 1/16W  Package / Case: 0402  [RES_0402]
U6  XCF32PFSG48C  [TFBGA-48_0.8MM_8X9]

### Blocks framed on the sheet
DECOUPLING: C200-C217

### Ports
JTAG_PROM (harness JTAG_HARNESS), PROM_CTRL (harness PROM_HARNESS), PROM_D[0..7] (out)

### Harnesses
PROM_HARNESS: EN_EXT_SEL, REV_SEL1, REV_SEL0, CLKOUT, ~{CEO}, OE/~{RESET}, CLK, ~{CE}, BUSY, ~{CF}
JTAG_HARNESS: TCK_PROM, TDO_PROM, TDI_PROM, TMS_PROM

### Nets
+1V8D: C211.1 C212.1 C213.1 C214.1 C215.1 C216.1 C217.1 U6.B1(VCCINT) U6.E1(VCCINT) U6.G6(VCCINT)
+3V3D: C200.1 C201.1 C202.1 C203.1 C204.1 C205.1 C206.1 C207.1 C208.1 C209.1 C210.1 R82.1 U6.B2(VCCO) U6.C6(VCCO) U6.D6(VCCO) U6.G5(VCCO) U6.H2(VCCJ)
GND: C200.2 C201.2 C202.2 C203.2 C204.2 C205.2 C206.2 C207.2 C208.2 C209.2 C210.2 C211.2 C212.2 C213.2 C214.2 C215.2 C216.2 C217.2 R79.2 R80.2 R81.2 U6.A1(GND) U6.A2(GND) U6.B6(GND) U6.F1(GND) U6.F5(GND) U6.F6(GND) U6.H1(GND)
~{CE}: U6.B4(~{CE}) ; port PROM_CTRL.~{CE}
~{CEO}: U6.D2(~{CEO}) ; port PROM_CTRL.~{CEO}
~{CF}: U6.D1(~{CF}) ; port PROM_CTRL.~{CF}
BUSY: R79.1 U6.C1(BUSY) ; port PROM_CTRL.BUSY
CLK: U6.B3(CLK) ; port PROM_CTRL.CLK
CLKOUT: U6.C2(CLKOUT) ; port PROM_CTRL.CLKOUT
EN_EXT_SEL: R82.2 U6.H4(~{EN_EXT_SEL}) ; port PROM_CTRL.EN_EXT_SEL
OE/RESET: U6.A3(OE/~{RESET}) ; port PROM_CTRL.OE/~{RESET}
PROM_D0: U6.H6(D0)
PROM_D1: U6.H5(D1)
PROM_D2: U6.E5(D2)
PROM_D3: U6.D5(D3)
PROM_D4: U6.C5(D4)
PROM_D5: U6.B5(D5)
PROM_D6: U6.A5(D6)
PROM_D7: U6.A6(D7)
PROM_TCK: U6.H3(TCK) ; port JTAG_PROM.TCK_PROM
PROM_TDI: U6.G1(TDI) ; port JTAG_PROM.TDI_PROM
PROM_TDO: U6.E6(TDO) ; port JTAG_PROM.TDO_PROM
PROM_TMS: U6.E2(TMS) ; port JTAG_PROM.TMS_PROM
REV_SEL0: R80.1 U6.G3(REV_SEL0) ; port PROM_CTRL.REV_SEL0
REV_SEL1: R81.1 U6.G4(REV_SEL1) ; port PROM_CTRL.REV_SEL1

Not connected (* = marked no-connect by the designer): U6 A4(DNC)* C3(DNC)* C4(DNC)* D3(DNC)* D4(DNC)* E3(DNC)* E4(DNC)* F2(DNC)* F3(DNC)* F4(DNC)* G2(DNC)*

### Buses and harness runs
bus PROM_D[0..7] = port PROM_D[0..7]

### Layout directives
net class PROM_COMM: (no net found under the mark), BUSY, CLK, CLKOUT, OE/RESET, ~{CEO}, ~{CE}, ~{CF}

### Notes on the sheet
- PROM
  SPEED = 40Mhz
  1V8 @ 10mA
  3V3 @ 45mA
- FREQ WANTED
  41.5, 124.5, 249 MHz
- Sheet Name
- Project Title
- Global Project
- Revision
- Size
- Date
- Group
- Sheet
- of
- Filename
- Designers

### Library data of the parts
C200 C211 = CAP_CER: as C533 on sheet POWER_SENSING; Operating Temperature: -55C - 125C; Temperature Coefficient: X7R; ComponentLink1Description: Digikey; ComponentLink1URL: [Digikey Link]; Part#: GCJ31CR71H105KA12L; ComponentLink2Description: Datasheet; ComponentLink2URL: [Datasheet Link]; Tolerance: 10%; Ratings: AEC-Q200
C201-C205 C212-C214 = CAP_CER: as C527 on sheet POWER_SENSING; Operating Temperature: -55C - 125C; Temperature Coefficient: X7R; ComponentLink1Description: Digikey; ComponentLink1URL: [Digikey Link]; Part#: GCM155R71H104KE02J; ComponentLink2Description: Datasheet; ComponentLink2URL: [Datasheet Link]; Tolerance: 10%; Ratings: AEC-Q200
C206-C210 C215-C217 = CAP_CER: GCM155R72A102KA37D / 0402 1nF 10% X7R Ceramic Capacitor; Mfr: Murata; Operating Temperature: -55C - 125C; Temperature Coefficient: X7R; ComponentLink1Description: Digikey; ComponentLink1URL: [Digikey Link]; Part#: GCM155R72A102KA37D; ComponentLink2Description: Datasheet; ComponentLink2URL: [Datasheet Link]; Tolerance: 10%; Ratings: AEC-Q200
R79-R82 = RESISTOR: Automotive: AEC-Q200; Operating Temperature: *; # Digikey: *; ComponentLink1Description: Digikey; ComponentLink1URL: *; # Manufacturer: *
U6 = XCF32PFSG48C: IC PROM SRL/PAR 1.8V 32M 48CSBGA; Mfr: Xilinx; Memory Size: 32Mb; Voltage - Suply: 1.65V - 2V; Part#: XCF32PFSG48C; Operating Temperature: -40C - 85C; ComponentLink1Description: Digikey; ComponentLink1URL: https://www.digikey.ca/en/products/detail/amd/XCF32PFSG48C/966638; ComponentLink2Description: Octopart; ComponentLink2URL: https://octopart.com/xcf32pfsg48c-xilinx-429660